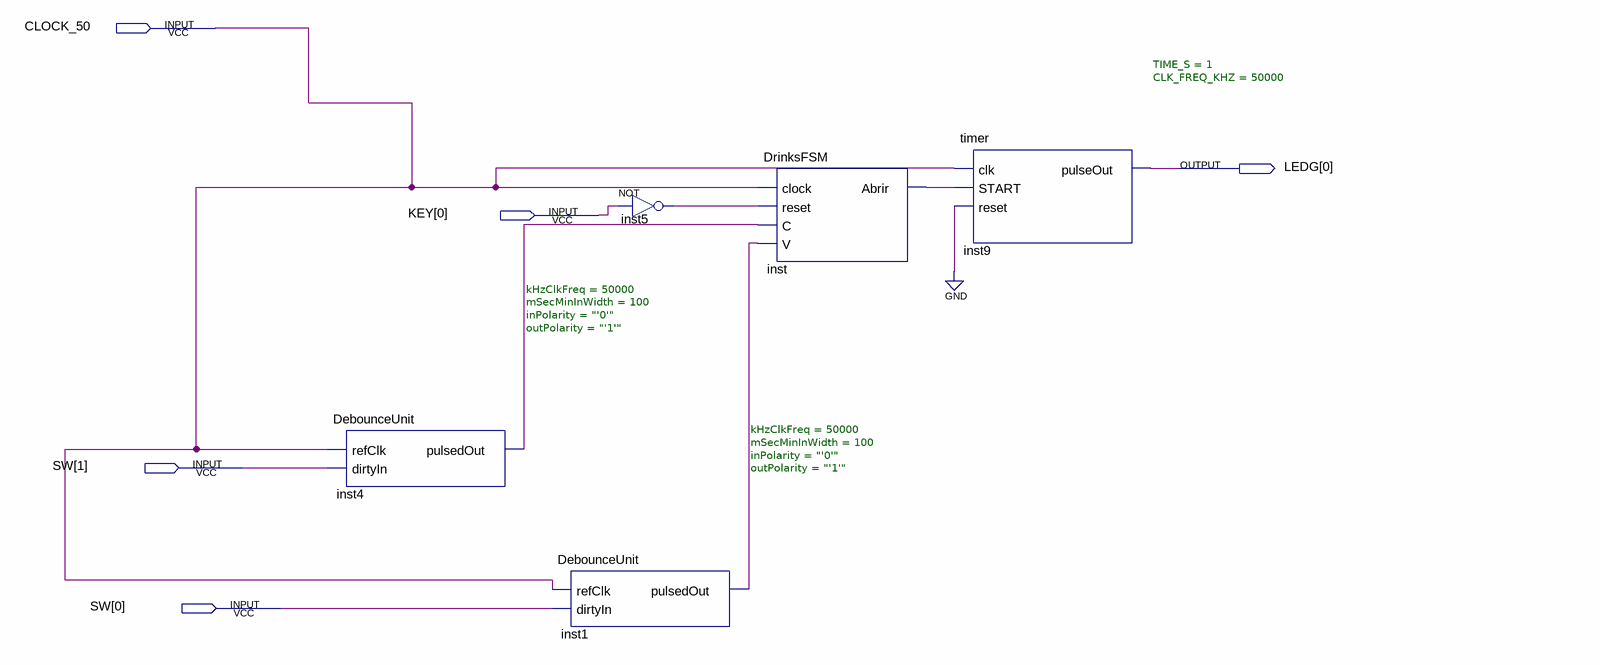
[diagram p0: schematic sheet]
// Quartus schematic DrinksMachine.bdf as structural Verilog: 5 symbols, 5 pins
module DrinksMachine (
  input  CLOCK_50,
  input  [0:0] KEY,
  input  [1:0] SW,
  output [0:0] LEDG
);

  wire inst1_pulsedout, inst4_pulsedout, inst5_out, inst_abrir;

  DebounceUnit #(.kHzClkFreq(50000), .mSecMinInWidth(100), .inPolarity("'0'"), .outPolarity("'1'")) inst4 (
    .refClk(CLOCK_50), .dirtyIn(SW[1]), .pulsedOut(inst4_pulsedout));
  DebounceUnit #(.kHzClkFreq(50000), .mSecMinInWidth(100), .inPolarity("'0'"), .outPolarity("'1'")) inst1 (
    .refClk(CLOCK_50), .dirtyIn(SW[0]), .pulsedOut(inst1_pulsedout));
  not inst5 (inst5_out, KEY[0]);
  DrinksFSM inst (.clock(CLOCK_50), .reset(inst5_out), .C(inst4_pulsedout), .V(inst1_pulsedout), .Abrir(inst_abrir));
  timer #(.TIME_S(1), .CLK_FREQ_KHZ(50000)) inst9 (
    .clk(CLOCK_50), .START(inst_abrir), .reset(1'b0), .pulseOut(LEDG[0]));
endmodule
